# Altium schematic sheet eeprom24c32.SchDoc
size A4; DocumentNumber: 7; SheetNumber: 7; SheetTotal: 11
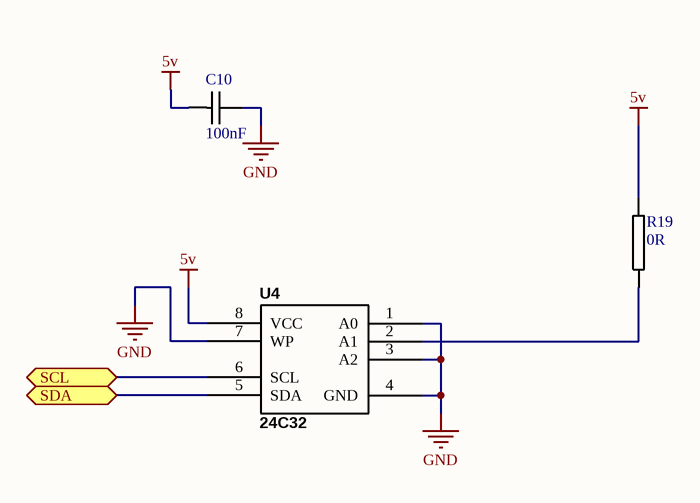
[diagram p0: eeprom24c32.SchDoc]

## Parts
C10  100nF  [0805C-TBD]
R19  0R  [0805R-GENERIC]
U4  24C32  [SO8]

## Ports
SCL, SDA

## Nets
5v: C10.1 R19.2 U4.8(VCC)
GND: C10.2 U4.1(A0) U4.3(A2) U4.4(GND) U4.7(WP)
SCL: U4.6(SCL) ; port SCL
SDA: U4.5(SDA) ; port SDA
NetR19_1: R19.1 U4.2(A1)

## Library data of the parts
C10 = 0805C-100nF-25V-X7R-MUR: CAPACITOR 0805 CERAMIC; Supplier 1: Digi-Key; Supplier Part Number 1: 490-1673-1-ND
R19 = 0805R-0R: RESISTOR 0805 1 WATT
U4 = 24C32: I2C EEPROM 4K X 8; Part Field 1: STM; Manufacturer Part Number: M24C32-WMN6TP; Manufacturer: STMicroelectronics; Description: IC EEPROM 32KBIT 400KHZ 8SOIC; Reel: U3; Part Field 2: M24C32-WMN6TP; Part Field 3: Digi-Key; Part Field 4: 497-5027-6-ND; Part Field 5: SERIAL I2C EEPROM; Supplier 1: Digi-Key; Supplier Part Number 1: 497-5027-2-ND